# EAGLE design AppleIIGSMem (EAGLE 9.2.1)
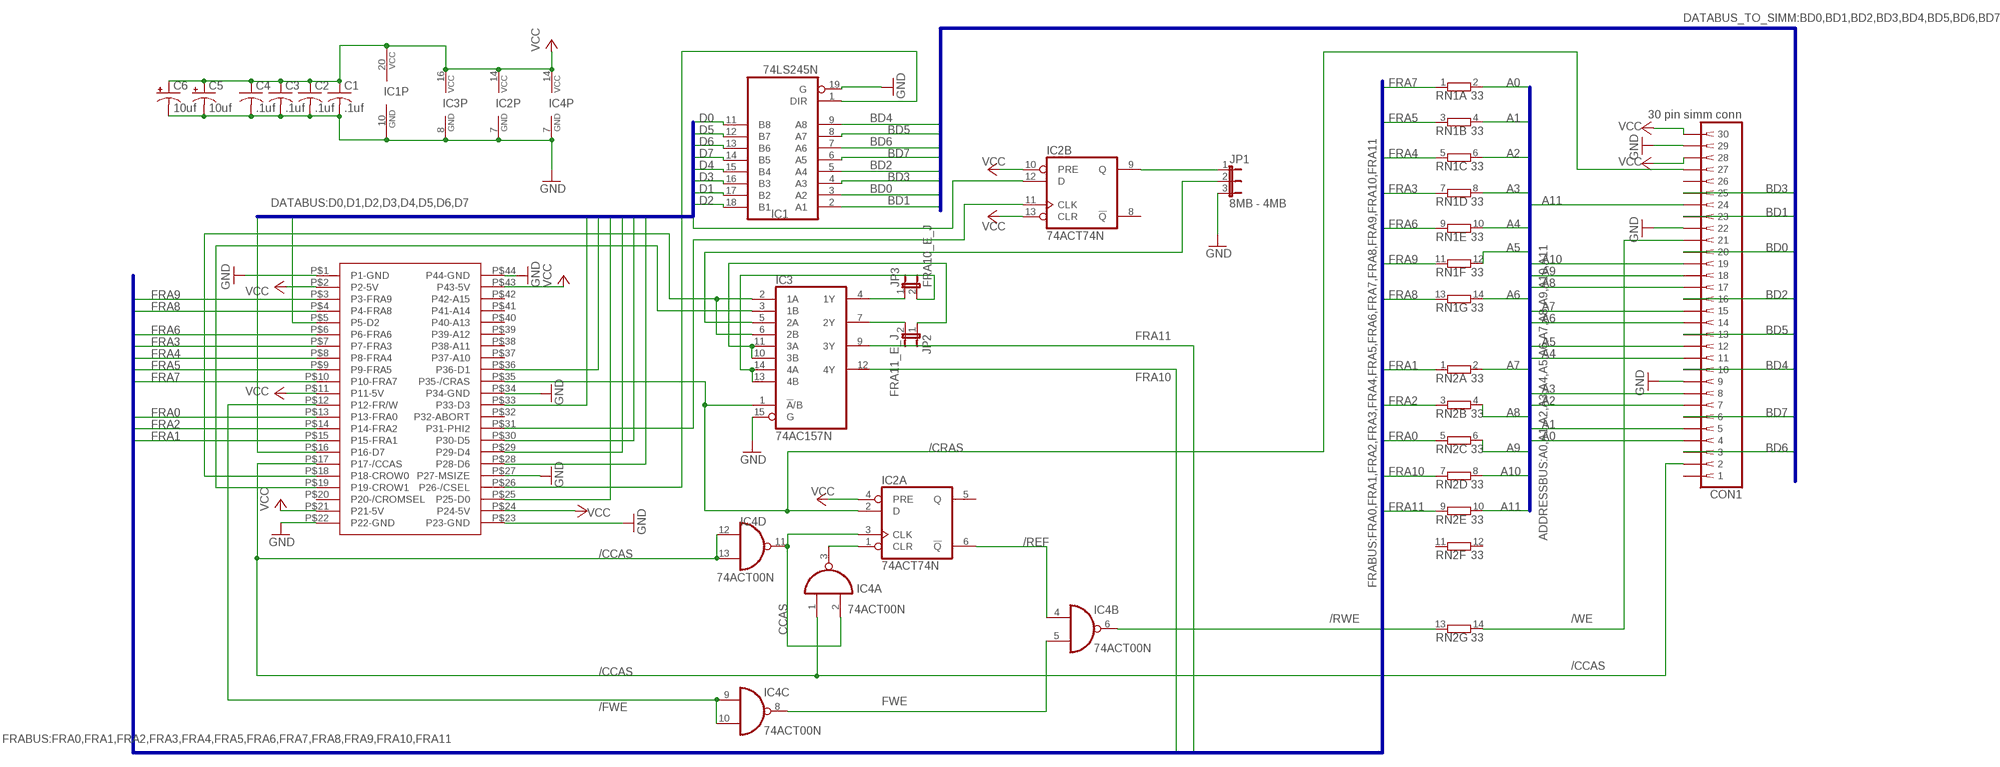
[diagram p0: schematic, sheet 1]

## Parts
C1  .1uf  C-US025-025X050  [C025-025X050]
C2  .1uf  C-US025-025X050  [C025-025X050]
C3  .1uf  C-US025-025X050  [C025-025X050]
C4  .1uf  C-US025-025X050  [C025-025X050]
C5  10uf  CPOL-USE2.5-5  [E2,5-5]
C6  10uf  CPOL-USE2.5-5  [E2,5-5]
CON1  30 pin simm conn  SIMM30  [SIMM30]
IC1  74LS245N  [DIL20]
IC2  74ACT74N  [DIL14]
IC3  74AC157N  [DIL16]
IC4  74ACT00N  [DIL14]
JP1  8MB - 4MB  JP2E  [JP2]
JP2  FRA11_E_J  JP1E  [JP1]
JP3  FRA10_E_J  JP1E  [JP1]
RN1  33  E7R  [SIL14]
RN2  33  E7R  [SIL14]
U$1  APPLE_IIGS_MEM_EXP_CARD_EDGE  [EDGE_FINGERS]

## Nets
74CLR1: IC2.1(A:CLR) IC4.3(A:O)
/CCAS: CON1.2 IC4.1(A:I0) IC4.12(D:I0) IC4.13(D:I1) U$1.P$17(P17-/CCAS)
/CRAS: CON1.27 IC2.2(A:D) IC3.1(!A!/B) U$1.P$35(P35-/CRAS)
/CSEL: IC1.1(DIR) U$1.P$26(P26-/CSEL)
/FWE: IC4.9(C:I0) IC4.10(C:I1) U$1.P$12(P12-FR/W)
/REF: IC2.6(A:!Q) IC4.4(B:I0)
/RWE: IC4.6(B:O) RN2.13
/WE: CON1.21 RN2.14
A0: CON1.4 RN1.2
A1: CON1.5 RN1.4
A2: CON1.7 RN1.6
A3: CON1.8 RN1.8
A4: CON1.11 RN1.10
A5: CON1.12 RN1.12
A6: CON1.14 RN1.14
A7: CON1.15 RN2.2
A8: CON1.17 RN2.4
A9: CON1.18 RN2.6
A10: CON1.19 RN2.8
A11: CON1.24 RN2.10
BD0: CON1.20 IC1.3(A2)
BD1: CON1.23 IC1.2(A1)
BD2: CON1.16 IC1.5(A4)
BD3: CON1.25 IC1.4(A3)
BD4: CON1.10 IC1.9(A8)
BD5: CON1.13 IC1.8(A7)
BD6: CON1.3 IC1.7(A6)
BD7: CON1.6 IC1.6(A5)
CCAS: IC2.3(A:CLK) IC4.2(A:I1) IC4.11(D:O)
CROW0: IC3.2(1A) IC3.6(2B) U$1.P$18(P18-CROW0)
CROW1: IC3.3(1B) U$1.P$19(P19-CROW1)
CROW2: IC3.5(2A) JP1.2
D0: IC1.11(B8) U$1.P$25(P25-D0)
D1: IC1.17(B2) U$1.P$36(P36-D1)
D2: IC1.18(B1) U$1.P$5(P5-D2)
D3: IC1.16(B3) U$1.P$33(P33-D3)
D4: IC1.15(B4) U$1.P$29(P29-D4)
D5: IC1.12(B7) U$1.P$30(P30-D5)
D6: IC1.13(B6) IC2.12(B:D) U$1.P$28(P28-D6)
D7: IC1.14(B5) U$1.P$16(P16-D7)
FRA0: RN2.5 U$1.P$13(P13-FRA0)
FRA1: RN2.1 U$1.P$15(P15-FRA1)
FRA2: RN2.3 U$1.P$14(P14-FRA2)
FRA3: RN1.7 U$1.P$7(P7-FRA3)
FRA4: RN1.5 U$1.P$8(P8-FRA4)
FRA5: RN1.3 U$1.P$9(P9-FRA5)
FRA6: RN1.9 U$1.P$6(P6-FRA6)
FRA7: RN1.1 U$1.P$10(P10-FRA7)
FRA8: RN1.13 U$1.P$4(P4-FRA8)
FRA9: RN1.11 U$1.P$3(P3-FRA9)
FRA10: IC3.12(4Y) RN2.7
FRA10_E: IC3.4(1Y) JP3.1
FRA11: IC3.9(3Y) RN2.9
FRA11_E: IC3.7(2Y) JP2.2
FWE: IC4.5(B:I1) IC4.8(C:O)
GND: C1.2 C2.2 C3.2 C4.2 C5.- C6.- CON1.9 CON1.22 CON1.29 IC1.10(GND) IC1.19(G) IC2.7(P:GND) IC3.8(GND) IC3.15(G) IC4.7(P:GND) JP1.3 U$1.P$1(P1-GND) U$1.P$22(P22-GND) U$1.P$23(P23-GND) U$1.P$27(P27-MSIZE) U$1.P$34(P34-GND) U$1.P$44(P44-GND)
N$2: IC2.9(B:Q) JP1.1
N$6: IC3.10(3B) IC3.11(3A) JP2.1
N$9: IC3.13(4B) IC3.14(4A) JP3.2
PHI2: IC2.11(B:CLK) U$1.P$31(P31-PHI2)
VCC: C1.1 C2.1 C3.1 C4.1 C5.+ C6.+ CON1.28 CON1.30 IC1.20(VCC) IC2.4(A:PRE) IC2.10(B:PRE) IC2.13(B:CLR) IC2.14(P:VCC) IC3.16(VCC) IC4.14(P:VCC) U$1.P$2(P2-5V) U$1.P$11(P11-5V) U$1.P$21(P21-5V) U$1.P$24(P24-5V) U$1.P$43(P43-5V)
Unconnected: CON1.1 CON1.26 IC2.5(A:Q) IC2.8(B:!Q) RN2.11 RN2.12 U$1.P$20(P20-/CROMSEL) U$1.P$32(P32-ABORT) U$1.P$37(P37-A10) U$1.P$38(P38-A11) U$1.P$39(P39-A12) U$1.P$40(P40-A13) U$1.P$41(P41-A14) U$1.P$42(P42-A15)

## Buses
DATABUS:D0,D1,D2,D3,D4,D5,D6,D7
FRABUS:FRA0,FRA1,FRA2,FRA3,FRA4,FRA5,FRA6,FRA7,FRA8,FRA9,FRA10,FRA11
ADDRESSBUS:A0,A1,A2,A3,A4,A5,A6,A7,A8,A9,A10,A11
DATABUS_TO_SIMM:BD0,BD1,BD2,BD3,BD4,BD5,BD6,BD7

## Library data of the parts
C1-C4 = resistor:C-US: CAPACITOR, American symbol
C5 C6 = rcl:CPOL-US: POLARIZED CAPACITOR, American symbol; SPICEPREFIX: C
CON1 = con-amp:SIMM30: AMP connector
IC1 = 74xx-us:74*245: Octal BUS TRANSCEIVER, 3-state
IC2 = 74xx-eu:74*74: Dual D type positive edge triggered FLIP FLOP, preset and clear
IC3 = 74xx-eu:74*157: Quadruple 2-line to 1-line data SELECTOR/MULTIPLEXER
IC4 = 74xx-eu:74*00: Quad 2-input NAND gate
JP1 = jumper:JP2E: JUMPER
JP2 JP3 = jumper:JP1E: JUMPER
RN1 RN2 = resistor-sil:E7R: SIL RESISTOR; OC_FARNELL: unknown; OC_NEWARK: unknown
U$1 = AppleIIGS:APPLE_IIGS_MEM_EXP_CARD_EDGE: Apple IIGS Memory Expansion Card Edge Fingers

## Board
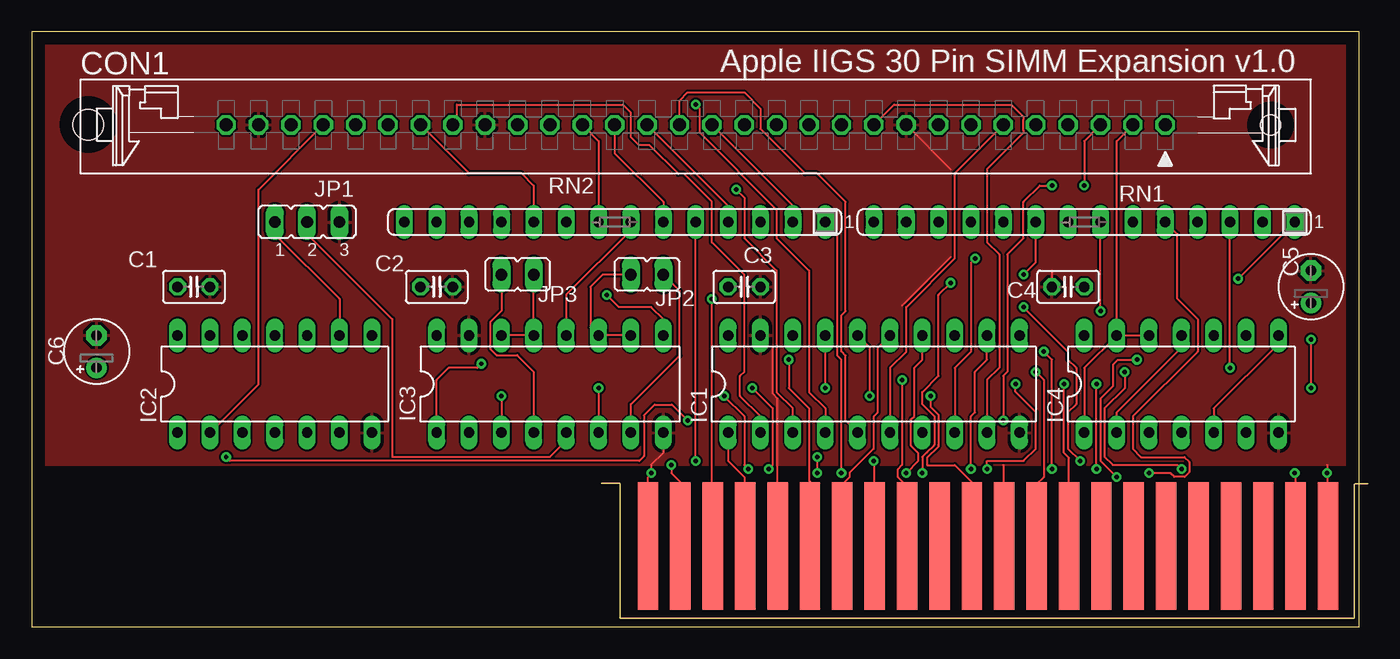
[diagram p1: board, top side]
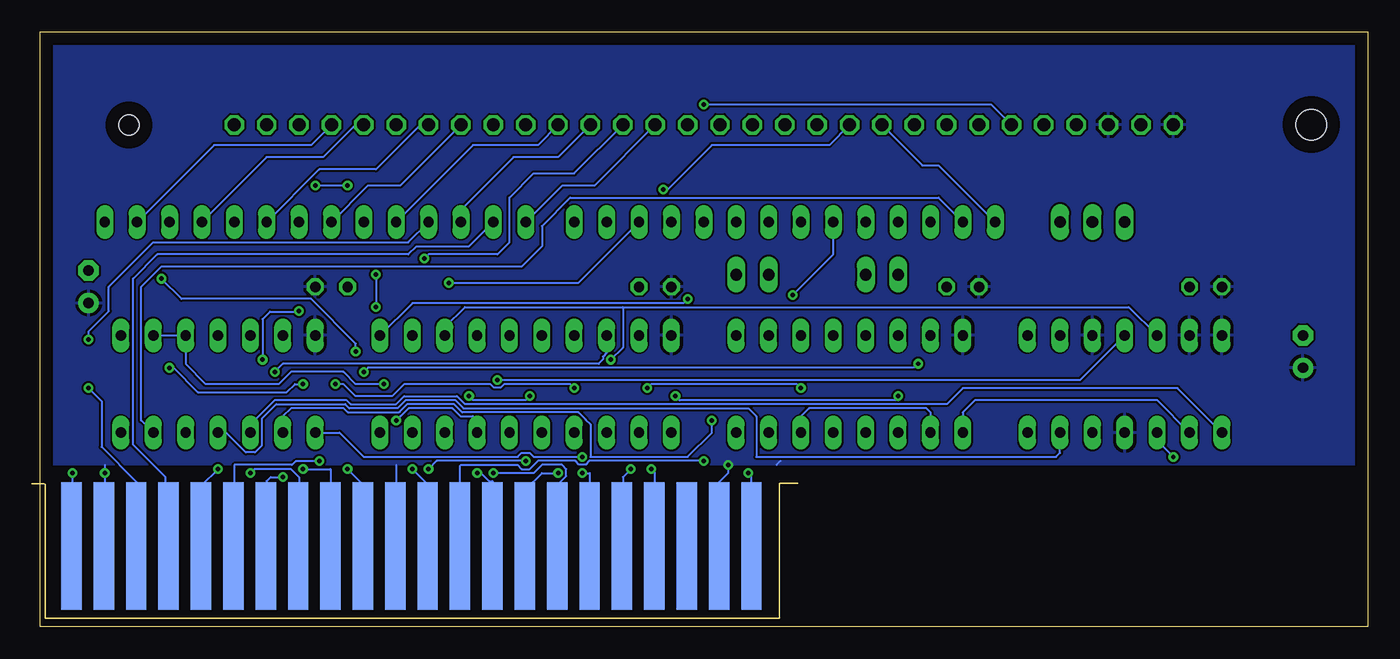
[diagram p2: board, bottom side, seen from below]

Size 104.12 x 46.66 mm. Coordinates in mm from the lower left corner, seen from the top.
Outline: 0,0 104.12,0 104.12,46.66 0,46.66 0,0
Copper layers (1*16): Top 0.035mm / dielectric 1.5mm / Bottom 0.035mm
Design rules "default": minimum track width 6mil, minimum drill 0.35mm, track to track 6mil, track to pad 6mil, pad to pad 6mil, via to via 6mil, smd to smd 6mil, copper to edge 40mil, drill to drill 6mil, minimum pad ring 10mil, minimum via ring 8mil, stop-mask expansion 4mil, vias tented up to drill 0mil, thermal gap 10mil

### Footprints (pad centres in the part's own frame; a part is rotated, then mirrored left to right if it is on the bottom)
C025-025X050 = drill 0.813 octagon: 1 -1.27,0; 2 1.27,0
E2,5-5 = drill 0.813 pad 1.6: + -1.27,0 | drill 0.813 pad 1.6 octagon: - 1.27,0
SIMM30 = drill 1.016 octagon: 1 36.83,0; 2 34.29,0; 3 31.75,0; 4 29.21,0; 5 26.67,0; 6 24.13,0; 7 21.59,0; 8 19.05,0; 9 16.51,0; 10 13.97,0; 11 11.43,0; 12 8.89,0; 13 6.35,0; 14 3.81,0; 15 1.27,0; 16 -1.27,0; 17 -3.81,0; 18 -6.35,0; 19 -8.89,0; 20 -11.43,0; 21 -13.97,0; 22 -16.51,0; 23 -19.05,0; 24 -21.59,0; 25 -24.13,0; 26 -26.67,0; 27 -29.21,0; 28 -31.75,0; 29 -34.29,0; 30 -36.83,0 | hole 2.413: -47.65,0.025 | hole 1.6: 45.085,0
DIL20 = drill 0.813 long: 1 -11.43,-3.81; 2 -8.89,-3.81; 3 -6.35,-3.81; 4 -3.81,-3.81; 5 -1.27,-3.81; 6 1.27,-3.81; 7 3.81,-3.81; 8 6.35,-3.81; 9 8.89,-3.81; 10 11.43,-3.81; 11 11.43,3.81; 12 8.89,3.81; 13 6.35,3.81; 14 3.81,3.81; 15 1.27,3.81; 16 -1.27,3.81; 17 -3.81,3.81; 18 -6.35,3.81; 19 -8.89,3.81; 20 -11.43,3.81
DIL14 = drill 0.813 long: 1 -7.62,-3.81; 2 -5.08,-3.81; 3 -2.54,-3.81; 4 0,-3.81; 5 2.54,-3.81; 6 5.08,-3.81; 7 7.62,-3.81; 8 7.62,3.81; 9 5.08,3.81; 10 2.54,3.81; 11 0,3.81; 12 -2.54,3.81; 13 -5.08,3.81; 14 -7.62,3.81
DIL16 = drill 0.813 long: 1 -8.89,-3.81; 2 -6.35,-3.81; 3 -3.81,-3.81; 4 -1.27,-3.81; 5 1.27,-3.81; 6 3.81,-3.81; 7 6.35,-3.81; 8 8.89,-3.81; 9 8.89,3.81; 10 6.35,3.81; 11 3.81,3.81; 12 1.27,3.81; 13 -1.27,3.81; 14 -3.81,3.81; 15 -6.35,3.81; 16 -8.89,3.81
JP2 = drill 0.914 long: 1 -2.54,0; 2 0,0; 3 2.54,0
JP1 = drill 0.914 long: 1 0,-1.27; 2 0,1.27
SIL14 = drill 0.813 long: 1 -16.51,0; 2 -13.97,0; 3 -11.43,0; 4 -8.89,0; 5 -6.35,0; 6 -3.81,0; 7 -1.27,0; 8 1.27,0; 9 3.81,0; 10 6.35,0; 11 8.89,0; 12 11.43,0; 13 13.97,0; 14 16.51,0
EDGE_FINGERS = smd 1.6 x 10 bottom: P$1 25.472,-5.08; P$2 22.932,-5.08; P$3 20.392,-5.08; P$4 17.852,-5.08; P$5 15.312,-5.08; P$6 12.772,-5.08; P$7 10.232,-5.08; P$8 7.692,-5.08; P$9 5.152,-5.08; P$10 2.612,-5.08; P$11 0.072,-5.08; P$12 -2.468,-5.08; P$13 -5.008,-5.08; P$14 -7.548,-5.08; P$15 -10.088,-5.08; P$16 -12.628,-5.08; P$17 -15.168,-5.08; P$18 -17.708,-5.08; P$19 -20.248,-5.08; P$20 -22.788,-5.08; P$21 -25.328,-5.08; P$22 -27.868,-5.08 | smd 1.6 x 10: P$23 -27.868,-5.08; P$24 -25.328,-5.08; P$25 -22.788,-5.08; P$26 -20.248,-5.08; P$27 -17.708,-5.08; P$28 -15.168,-5.08; P$29 -12.628,-5.08; P$30 -10.088,-5.08; P$31 -7.548,-5.08; P$32 -5.008,-5.08; P$33 -2.468,-5.08; P$34 0.072,-5.08; P$35 2.612,-5.08; P$36 5.152,-5.08; P$37 7.692,-5.08; P$38 10.232,-5.08; P$39 12.772,-5.08; P$40 15.312,-5.08; P$41 17.852,-5.08; P$42 20.392,-5.08; P$43 22.932,-5.08; P$44 25.472,-5.08

### Placement (x,y rotation side)
C1  12.7,26.67 0 top
C2  31.75,26.67 0 top
C3  55.88,26.67 0 top
C4  81.28,26.67 180 top
C5  100.33,26.67 90 top
C6  5.08,21.59 90 top
CON1  52.07,39.37 0 top
IC1  66.04,19.05 0 top
IC2  19.05,19.05 0 top
IC3  40.64,19.05 0 top
IC4  90.17,19.05 0 top
JP1  21.59,31.75 0 top
JP2  48.26,27.62 270 top
JP3  38.1,27.62 270 top
RN1  82.55,31.75 180 top
RN2  45.72,31.75 180 top
U$1  76.2,11.43 0 top

### Tracks (layer width: path | path; a pad name or v marks a point on that pad's centre or on a via)
74CLR1
  Bottom 0.152: IC4.3 87.63,15.88 85.72,17.78 80.09,17.78 79.77,17.46 76.2,17.46 75.56,18.1 71.44,18.1 70.8,17.46 33.02,17.46 31.75,18.73 14.92,18.73 IC2.1
/CCAS  (via drill 0.35)
  Top 0.152: IC4.13 IC4.12 | CON1.2 85.09,38.1 IC4.13 | v61.59,13.34 v61.59,12.06 | IC4.13 85.09,22.85 82.55,20.31 IC4.1
  Bottom 0.152: v61.59,12.06 61.03,12.06 U$1.P$17 | v61.59,13.34 65.41,13.34 65.72,13.65 66.36,13.65 66.67,13.34 78.74,13.34 80.64,15.24 IC4.1
/CRAS  (via drill 0.35)
  Top 0.152: CON1.27 17.78,34.29 17.78,19.05 IC2.2 | U$1.P$35 78.81,11.18 79.38,11.75 79.38,19.37 v78.74,20 | v35.24,20.64 34.92,20.32 32.7,20.32 31.75,19.37 IC3.1
  Bottom 0.152: IC3.1 31.75,16.83 30.8,17.78 16.51,17.78 IC2.2 | v35.24,20.64 35.34,20.64 35.64,20.33 78.41,20.33 v78.74,20
/CSEL
  Top 0.152: U$1.P$26 55.88,6.35 55.88,11.75 54.61,13.02 IC1.1
/FWE  (via drill 0.35)
  Top 0.152: v74.93,12.38 74.93,13.02 77.79,13.02 78.74,13.97 78.74,16.84 77.15,18.43 v77.15,19.05
  Bottom 0.152: IC4.9 IC4.10 92.71,20.64 91.12,19.05 85.41,19.05 84.45,20 80.33,20 79.38,19.05 v77.15,19.05 | v74.93,12.38 73.73,11.18 U$1.P$12
/REF
  Bottom 0.152: IC2.6 24.13,13.65 24.45,13.34 47.94,13.34 47.94,16.51 48.58,17.14 70.92,17.14 71.54,17.77 75.46,17.77 76.07,17.16 79.87,17.16 79.88,17.14 80.2,17.46 85.61,17.46 86.74,16.33 86.74,14.21 87.26,13.69 88,13.69 89.55,15.24 IC4.4
/RWE
  Bottom 0.152: RN2.13 33.66,33.66 62.55,33.66 64.77,31.43 64.77,29.84 66.36,28.26 94.61,28.26 96.2,26.67 96.2,16.19 IC4.6
/WE
  Bottom 0.152: RN2.14 33.66,36.2 34.92,36.2 CON1.21
A0
  Bottom 0.152: RN1.2 90.49,37.78 82.87,37.78 CON1.4
A1
  Bottom 0.152: RN1.4 86.36,36.83 81.92,36.83 79.38,39.37 CON1.5
A2
  Bottom 0.152: RN1.6 82.23,35.88 77.79,35.88 74.3,39.37 CON1.7
A3
  Bottom 0.152: RN1.8 78.42,34.61 75.88,34.61 CON1.8
A4
  Bottom 0.152: RN1.10 70.17,37.78 65.09,37.78 CON1.11
A5
  Bottom 0.152: CON1.12 63.5,36.83 66.99,36.83 71.12,32.7 RN1.12
A6
  Bottom 0.152: RN1.14 63.18,34.61 60.64,34.61 CON1.14
A7
  Top 0.152: RN2.2 59.69,33.02 CON1.15
A8
  Top 0.152: RN2.4 54.61,33.02 CON1.17
A9
  Top 0.152: RN2.6 49.53,33.34 45.72,37.15 CON1.18
A10
  Top 0.152: RN2.8 44.45,38.1 CON1.19
A11
  Top 0.152: RN2.10 39.37,34.61 38.42,35.56 34.29,35.56 CON1.24
BD0  (via drill 0.35)
  Top 0.152: IC1.3 59.69,17.14 58.42,18.41 58.42,27.94 55.88,30.48 55.88,33.66 v55.24,34.29
  Bottom 0.152: v55.24,34.29 54.93,34.29 51.44,37.78 42.23,37.78 CON1.20
BD1
  Top 0.152: CON1.23 33.34,39.69 33.34,40.96 46.35,40.96 46.99,40.32 46.99,38.42 47.62,37.78 48.45,37.78 50.71,35.52 51.16,35.52 53.34,33.34 53.34,30.16 55.88,27.62 55.88,20 55.56,19.68 55.56,18.1 57.15,16.51 IC1.2
BD2
  Top 0.152: IC1.5 63.82,16.19 63.82,21.27 63.49,21.6 63.49,24.43 63.82,24.77 63.82,33.34 61.59,35.56 60.64,35.56 57.15,39.05 57.15,40.64 55.88,41.91 51.44,41.91 50.8,41.27 CON1.16
BD3  (via drill 0.35)
  Top 0.152: IC1.4 62.23,17.14 60.96,18.41 60.96,27.94 58.42,30.48 58.42,32.7 52.35,38.77 52.35,40.68 v52.07,40.96
  Bottom 0.152: v52.07,40.96 29.53,40.96 CON1.25
BD4
  Top 0.152: IC1.9 74.93,19.37 75.88,20.32 75.88,29.21 74.93,30.16 74.93,35.88 77.79,38.73 77.79,38.92 77.75,38.96 77.75,39.78 77.79,39.82 77.79,40.01 76.83,40.96 67.63,40.96 CON1.10
BD5  (via drill 0.35)
  Top 0.152: IC1.8 72.39,20.32 73.66,21.59 73.66,28.57 v73.98,28.89
  Bottom 0.152: v73.98,28.89 73.66,29.21 68.26,29.21 67.31,30.16 67.31,33.66 65.41,35.56 62.23,35.56 CON1.13
BD6  (via drill 0.35)
  Top 0.152: v76.2,16.19 76.2,19.68 76.52,20 76.52,29.21 77.79,30.48 77.79,33.34 79.06,34.61 v80.01,34.61 | CON1.3 82.55,38.1 v82.55,34.61
  Bottom 0.152: v80.01,34.61 v82.55,34.61 | v76.2,16.19 75.86,16.54 75.83,16.54 75.22,17.14 71.78,17.14 71.16,16.52 70.18,16.52 69.85,16.19 IC1.7
BD7
  Top 0.152: IC1.6 67.31,20.32 68.58,21.59 68.58,25.08 72.39,28.89 72.39,35.56 CON1.6
CCAS  (via drill 0.35)
  Top 0.152: IC4.11 90.17,21.91 85.09,16.83 IC4.2 | v15.24,13.34 15.54,13.03 47.65,13.03 48.01,13.39 48.01,16.59 48.84,17.42 50.2,17.42 v51.44,16.19
  Bottom 0.152: IC4.2 85.09,16.51 84.45,17.14 80.31,17.14 80,16.83 80,16.84 75.96,16.84 75.93,16.87 75.34,17.46 71.67,17.46 71.03,16.83 61.9,16.83 61.34,16.27 61.34,16.26 60.96,15.88 60.96,13.34 53.34,13.34 51.44,15.24 v51.44,16.19 | v15.24,13.34 16.51,14.61 IC2.3
CROW0  (via drill 0.35)
  Top 0.152: v44.45,18.73 IC3.6 | v56.52,18.73 v56.53,18.73 58.1,17.16 58.1,12.7 v57.78,12.38
  Bottom 0.152: IC3.2 34.29,16.83 34.61,17.14 43.81,17.14 44.45,16.51 IC3.6 | v57.78,12.38 58.42,11.75 58.42,6.42 U$1.P$18 | v44.45,18.73 44.77,19.05 56.2,19.05 v56.52,18.73
CROW1  (via drill 0.35)
  Top 0.152: v36.83,18.1 IC3.3 | v54.29,18.1 55.88,16.51 55.88,12.7 v56.2,12.38
  Bottom 0.152: v36.83,18.1 36.83,17.77 53.96,17.77 v54.29,18.1 | v56.2,12.38 55.95,12.14 U$1.P$19
CROW2
  Top 0.152: IC3.5 41.91,14.61 40.64,13.34 28.26,13.34 28.26,24.13 21.59,30.8 JP1.2
D0  (via drill 0.35)
  Top 0.152: v53.34,25.72 53.34,6.35 U$1.P$25
  Bottom 0.152: IC1.11 74.93,25.4 53.66,25.4 v53.34,25.72
D1  (via drill 0.35)
  Top 0.152: v62.23,18.73 IC1.17 | U$1.P$36 81.35,13.26 80.96,13.65 v80.96,19.05
  Bottom 0.152: v62.23,18.73 62.55,19.05 67.72,19.05 68.01,18.76 68.51,18.76 68.8,19.05 75.56,19.05 76.52,18.1 79.38,18.1 80.33,19.05 v80.96,19.05
D2  (via drill 0.35)
  Top 0.152: v85.72,20 85.72,18.73 84.14,17.14 84.14,13.34 84.77,12.7 89.85,12.7 v90.17,12.38
  Bottom 0.152: v85.72,20 85.09,20.64 60.33,20.64 59.98,20.98 59.98,21.21 59.69,21.5 IC1.18 | v90.17,12.38 91.44,11.11 91.44,6.42 U$1.P$5
D3  (via drill 0.35)
  Top 0.152: IC1.16 65.72,21.91 v65.72,18.1 | U$1.P$33 73.73,11.36 72.4,12.69 70.22,12.69 70.22,13.27 71.11,14.15 71.11,14.28 71.12,14.29 71.12,16.62 70.48,17.26 v70.48,18.1
  Bottom 0.152: v65.72,18.1 66.04,17.78 70.17,17.78 v70.48,18.1
D4
  Top 0.152: IC1.15 66.36,21.91 66.36,16.83 66.04,16.51 66.04,13.97 66,13.97 64.14,12.1 64.14,11.75 63.5,11.11 63.5,6.42 U$1.P$29
D5  (via drill 0.35)
  Top 0.152: IC1.12 74.93,20.95 73.98,20 73.98,16.83 73.66,16.51 v73.66,12.38 | v66.04,13.02 66.04,6.42 U$1.P$30
  Bottom 0.152: v73.66,12.38 73.03,13.02 v66.04,13.02
D6  (via drill 0.35)
  Top 0.152: v59.37,20.95 59.37,18.73 60.96,17.14 60.96,11.43 61.03,11.43 U$1.P$28
  Bottom 0.152: IC2.12 18.73,25.08 58.42,25.08 | IC1.13 72.39,23.5 70.8,25.08 58.42,25.08 | v59.37,20.95 58.42,21.91 58.42,25.08
D7  (via drill 0.35)
  Top 0.152: IC1.14 69.85,20.95 69.22,20.32 69.22,16.52 68.96,16.27 68.96,14.21 69.53,13.64 69.53,13.02 v68.58,12.06
  Bottom 0.152: v68.58,12.06 65.41,12.06 64.77,12.7 63.18,12.7 62.87,12.38 62.87,11.82 63.57,11.11 U$1.P$16
FRA0  (via drill 0.35)
  Top 0.152: v52.07,13.02 RN2.5
  Bottom 0.152: U$1.P$13 71.19,12.63 71.12,12.7 66.67,12.7 66.36,12.38 65.72,12.38 65.09,13.02 62.14,13.02 61.85,12.73 61.34,12.73 61.05,13.02 v52.07,13.02
FRA1  (via drill 0.35)
  Top 0.152: RN2.1 63.18,30.8 63.18,21.27 63.5,20.95 v63.5,12.06
  Bottom 0.152: v63.5,12.06 64.77,12.06 66.04,10.79 66.04,6.35 U$1.P$15
FRA2  (via drill 0.35)
  Top 0.152: v72.07,26.99 71.12,26.04 71.12,19.68 69.85,18.41 69.85,17.46 70.8,16.51 70.8,14.29 70.74,14.22 70.74,14.21 70.22,13.69 70.21,13.69 69.85,13.34 v69.85,12.06
  Bottom 0.152: RN2.3 61.91,26.99 v72.07,26.99 | v69.85,12.06 69.53,12.06 68.9,11.43 68.65,11.43 U$1.P$14
FRA3  (via drill 0.35)
  Top 0.152: v83.82,24.77 RN1.7 | v85.09,11.75 83.82,13.02 83.82,17.89 84.8,18.87 84.8,20.57 85.16,20.93 86.65,20.93 v86.68,20.95
  Bottom 0.152: v85.09,11.75 86.04,11.75 86.36,11.43 86.36,6.42 U$1.P$7 | v83.82,24.77 83.86,24.73 86.09,24.73 86.68,24.14 v86.68,20.95
FRA4  (via drill 0.35)
  Top 0.152: RN1.5 89.85,30.8 89.85,25.72 91.44,24.13 91.44,21.59 86.36,16.51 86.36,13.96 87,13.32 90.41,13.32 90.78,12.95 90.78,12.13 90.42,11.78 89.6,11.78 89.31,12.06 v87.63,12.06
  Bottom 0.152: U$1.P$8 83.82,6.42 83.82,11.75 84.45,12.38 87.31,12.38 v87.63,12.06
FRA5  (via drill 0.35)
  Top 0.152: v93.98,20.32 RN1.3 | v83.5,12.38 v83.5,19.05
  Bottom 0.152: v93.98,20.32 93.66,20.32 91.76,18.41 84.77,18.41 84.14,19.05 v83.5,19.05 | v83.5,12.38 81.35,12.38 U$1.P$9
FRA6  (via drill 0.35)
  Top 0.152: v77.79,25.08 81.28,21.59 81.28,20.95 81.92,20.32 81.92,17.46 81.28,16.83 81.28,13.97 v82.23,13.02 | RN1.9 78.73,31.74 78.73,28.56 v77.79,27.62
  Bottom 0.152: U$1.P$6 88.9,6.35 88.9,12.7 84.36,12.7 84.07,12.99 82.26,12.99 v82.23,13.02 | v77.79,27.62 v77.79,25.08
FRA7  (via drill 0.35)
  Top 0.152: v94.61,27.3 RN1.1 | v79.38,21.59 80.01,20.95 v80.01,12.38
  Bottom 0.152: v94.61,27.3 93.03,25.72 82.87,25.72 79.38,22.23 v79.38,21.59 | v80.01,12.38 78.74,11.11 78.74,6.42 U$1.P$10
FRA8
  Bottom 0.152: RN1.13 70.48,29.84 74.61,29.84 75.25,29.21 94.93,29.21 96.84,27.3 96.84,14.29 94.3,11.75 94.3,6.35 U$1.P$4
FRA9  (via drill 0.35)
  Top 0.152: v100.33,22.54 v100.33,18.73
  Bottom 0.152: RN1.11 75.25,30.16 95.25,30.16 98.74,26.67 98.74,24.77 100.33,23.18 v100.33,22.54 | v100.33,18.73 99.31,17.72 99.31,14.11 96.59,11.39 U$1.P$3
FRA10
  Top 0.152: IC3.12 41.91,26.04 46.99,31.11 RN2.7
FRA10_E
  Top 0.152: JP3.1 36.83,24.78 35.94,23.89 35.94,21.83 36.46,21.31 38.06,21.31 39.37,20 IC3.4
FRA11  (via drill 0.35)
  Top 0.152: IC3.9 49.53,24.13 48.58,25.08 46.04,25.08 v45.09,26.04
  Bottom 0.152: v45.09,26.04 41.91,29.21 RN2.9
FRA11_E
  Top 0.152: IC3.7 46.99,17.46 50.8,21.27 50.8,26.35 JP2.2
FWE
  Top 0.152: IC4.5 92.71,17.14 97.79,22.23 IC4.8
GND  (via drill 0.35)
  Top 0.152: 76.2,12.7 76.2,6.35 U$1.P$34 | 101.6,12.7 v101.6,12.06 101.6,6.35 U$1.P$44 | C4.2 80.01,27.94 79.28,27.94 | 72.08,29.02 68.28,25.21 | CON1.9 72.08,35.87 | IC3.8 49.53,13.65 48.58,12.7 v48.58,12.06 48.58,11.99 48.33,11.75 U$1.P$23 | U$1.P$27 58.49,17.91 58.12,18.29 58.12,21.89
  Bottom 0.152: v101.6,12.06 101.6,6.35 U$1.P$44 | U$1.P$23 48.33,11.75 48.58,11.99 v48.58,12.06
  pour Top: 0,12.7 104.14,12.7 104.14,46.99 0,46.99
N$2
  Top 0.152: IC2.9 24.13,25.72 19.05,30.8 JP1.1
N$6
  Top 0.152: IC3.10 IC3.11 43.81,23.5 43.81,26.67 44.77,27.62 JP2.1
N$9
  Top 0.152: IC3.14 IC3.13 JP3.2
PHI2  (via drill 0.35)
  Top 0.152: v68.26,19.37 68.26,12.7 67.94,12.38 67.94,11.75 68.65,11.04 U$1.P$31
  Bottom 0.152: IC2.11 22.54,19.37 v68.26,19.37
VCC  (via drill 0.35)
  Top 0.152: U$1.P$24 50.87,11.36 50.16,12.06 v50.16,12.7 | U$1.P$43 99.13,11.99 v99.06,12.06
  Bottom 0.152: 76.2,12.7 76.2,6.35 U$1.P$11 | 99.06,12.7 v99.06,12.06 99.06,6.35 U$1.P$43 | U$1.P$24 50.87,11.36 50.16,12.06 v50.16,12.7 | 46.35,12.7 46.04,13.02
  pour Bottom: 0,12.7 104.14,12.7 104.14,46.35 0,46.35

### Text on the board
tNames: Apple IIGS 30 Pin SIMM Expansion v1.0